# Altium project TASK_3.PrjPcb
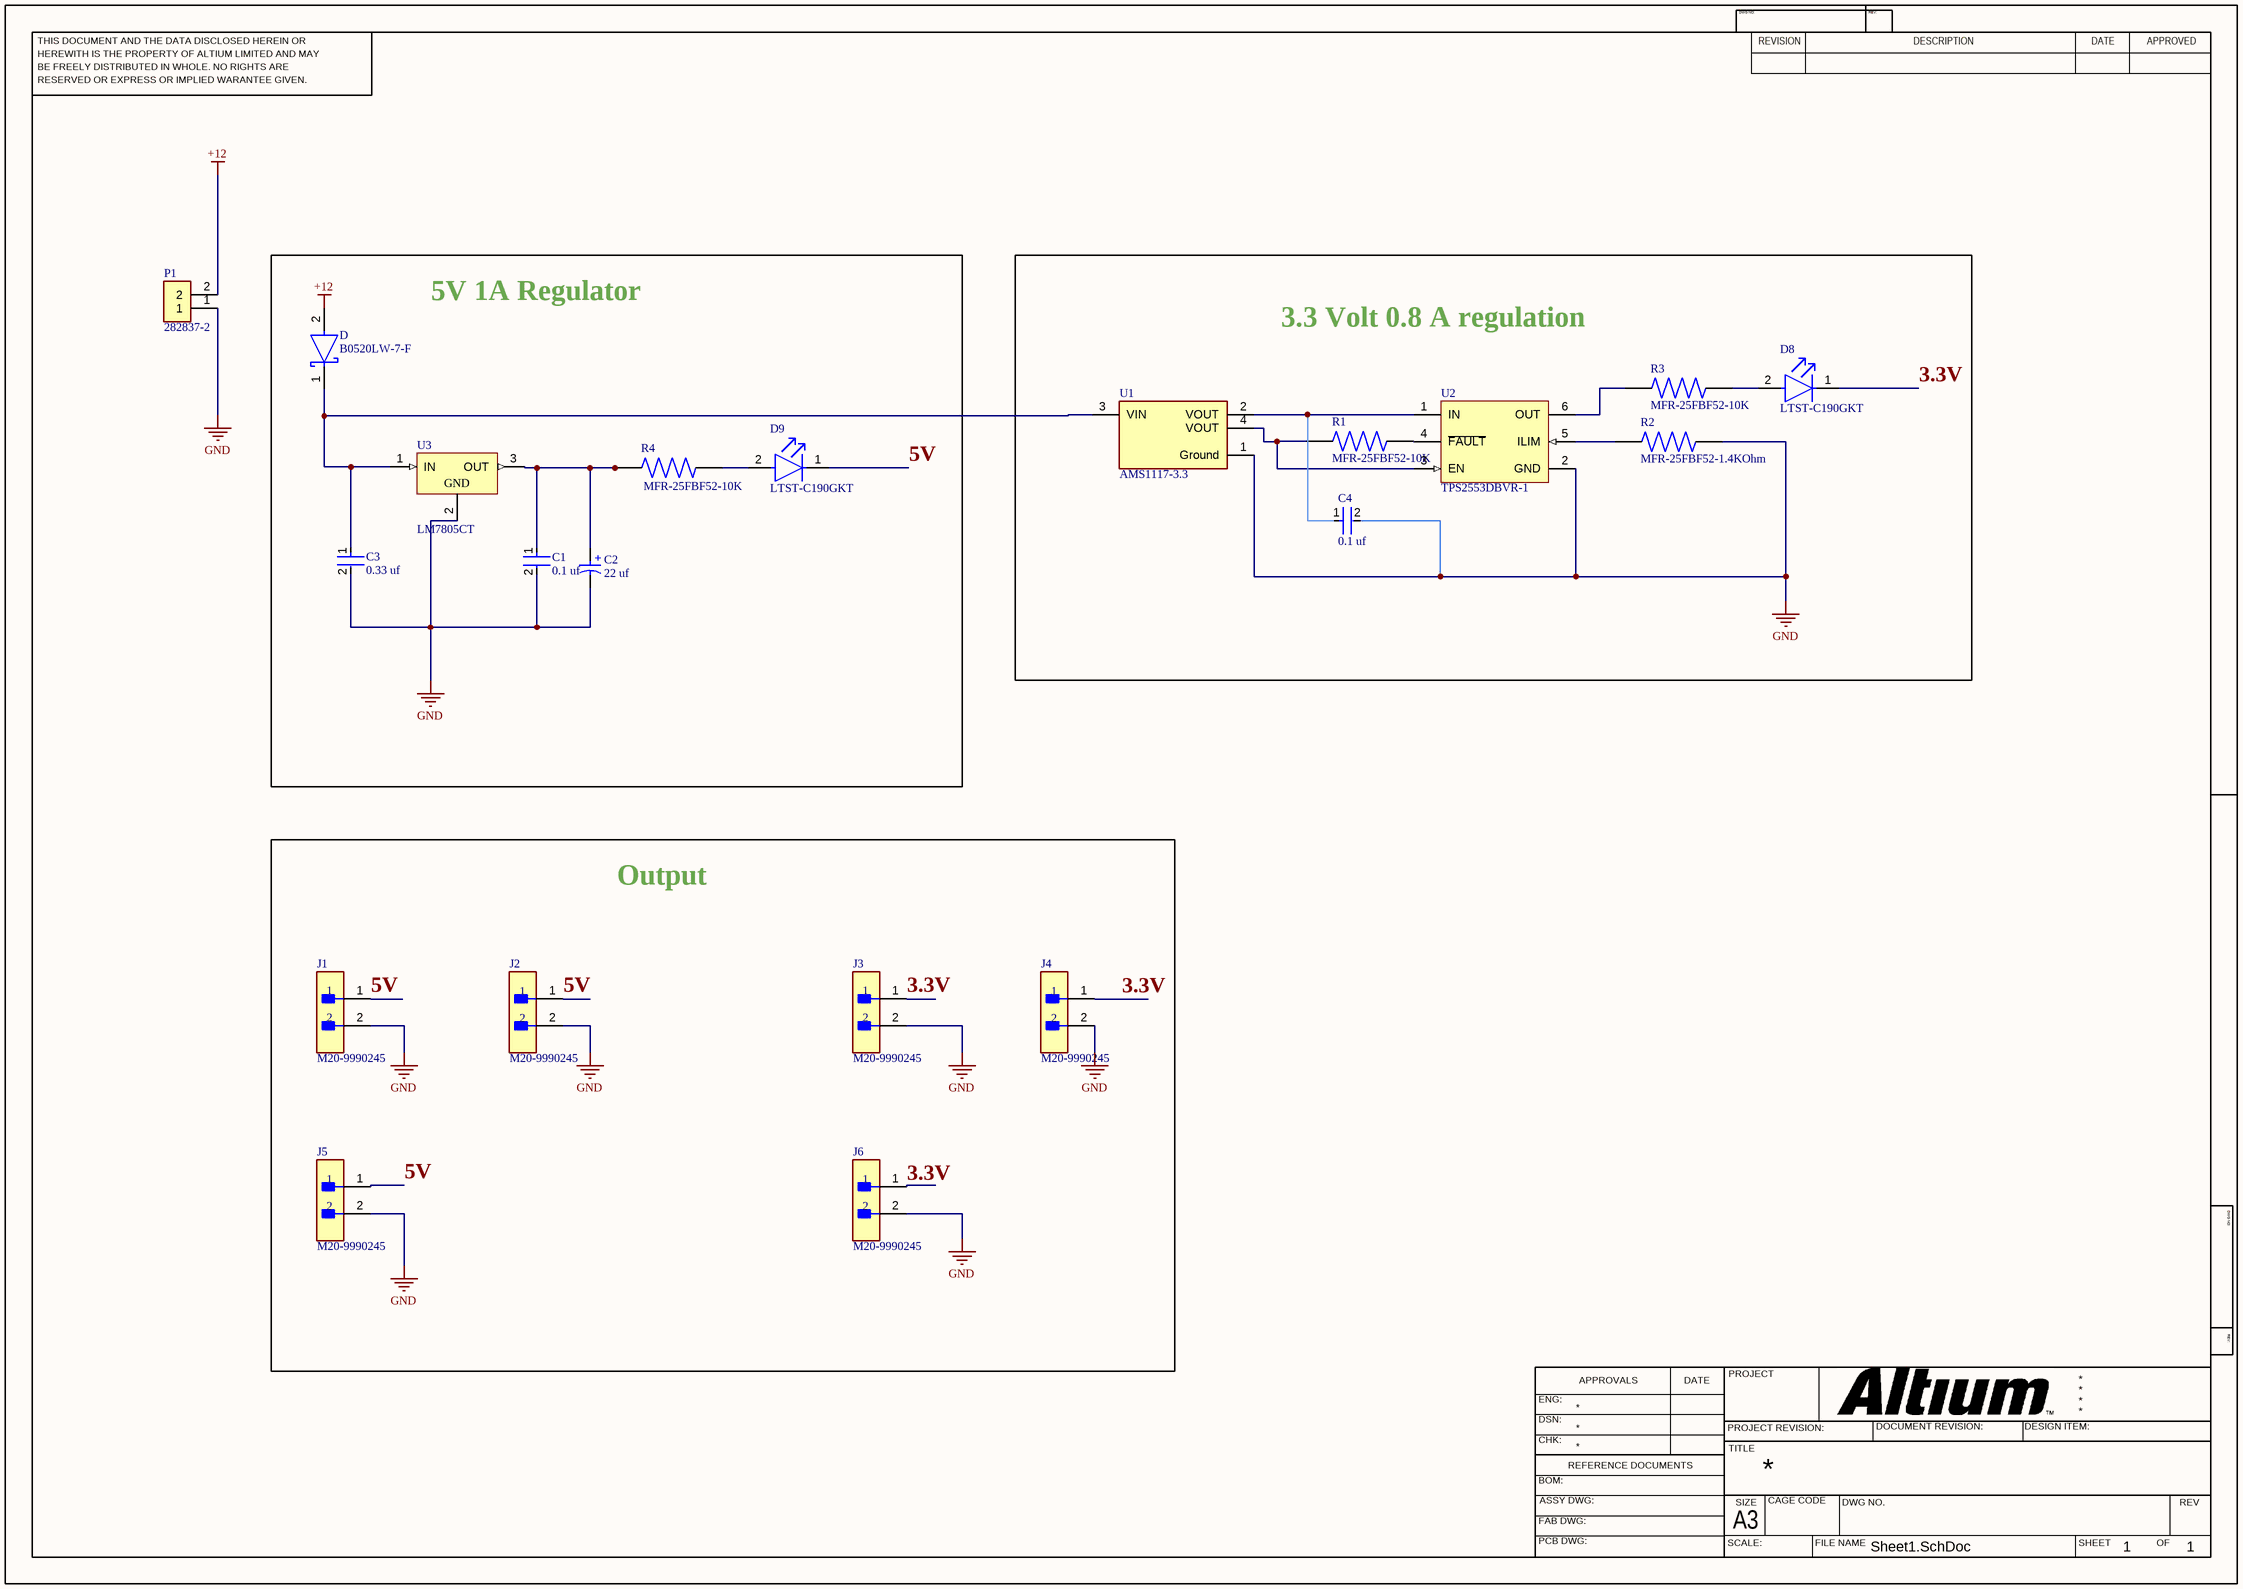
[diagram p0: Sheet1.SchDoc]
1 sheet, 21 parts. Net scope: global (net labels, ports and power ports of the same name join across sheets).
Board file: PCB1.PcbDoc

## Sheet Sheet1.SchDoc
size 420 x 297 mm; SheetNumber: 1; SheetTotal: 1

### Parts
C1  0.1 uf  [FP-CL17-IPC_C]
C2  22 uf  [WCAP-ASLL_D4H5.5]
C3  0.33 uf  [FP-GRM31C-0_2-e0_3_0_8-IPC_C]
C4  0.1 uf  [FP-CL17-IPC_C]
D  B0520LW-7-F  [FP-SOD123-MFG]
D8  LTST-C190GKT  [FP-LTST-C190GKT-MFG]
D9  LTST-C190GKT  [FP-LTST-C190GKT-MFG]
J1  M20-9990245  [FP-M20-9990245-MFG]
J2  M20-9990245  [FP-M20-9990245-MFG]
J3  M20-9990245  [FP-M20-9990245-MFG]
J4  M20-9990245  [FP-M20-9990245-MFG]
J5  M20-9990245  [FP-M20-9990245-MFG]
J6  M20-9990245  [FP-M20-9990245-MFG]
P1  282837-2  [TE_282837-2]
R1  MFR-25FBF52-10K  [RESAD1100W55L680D260]
R2  MFR-25FBF52-1.4KOhm  [RESAD1100W55L680D260]
R3  MFR-25FBF52-10K  [RESAD1100W55L680D260]
R4  MFR-25FBF52-10K  [RESAD1100W55L680D260]
U1  AMS1117-3.3  [FP-AMS1117-IPC_C]
U2  TPS2553DBVR-1  [DBV0006A_N]
U3  LM7805CT  [FAIR-TO-220-3]

### Blocks framed on the sheet
5V 1A Regulator: C1-C3 D D9 R4 U3
3.3 Volt 0.8 A regulation: C4 D8 R1-R3 U1 U2
Output: J1-J6

### Nets
+12: D.2(A) P1.2
GND: C1.2 C2.2(N) C3.2 C4.2 J1.2 J2.2 J3.2 J4.2 J5.2 J6.2 P1.1 R2.2 U1.1(Ground) U2.2(GND) U3.2(GND)
3.3V: D8.1(C) J3.1 J4.1 J6.1
5V: D9.1(C) J1.1 J2.1 J5.1
NetC1_1: C1.1 C2.1(P) R4.1 U3.3(OUT)
NetC3_1: C3.1 D.1(C) U1.3(VIN) U3.1(IN)
NetC4_1: C4.1 U1.2(VOUT) U2.1(IN)
NetD8_2: D8.2(A) R3.2
NetD9_2: D9.2(A) R4.2
NetR1_1: R1.1 U1.4(VOUT) U2.3(EN)
NetR1_2: R1.2 U2.4(~{FAULT})
NetR2_1: R2.1 U2.5(ILIM)
NetR3_1: R3.1 U2.6(OUT)

### Notes on the sheet
- THIS DOCUMENT AND THE DATA DISCLOSED HEREIN OR
- HEREWITH IS THE PROPERTY OF ALTIUM LIMITED AND MAY
- DWG NO:
- REVISION
- REV:
- DESCRIPTION
- DATE
- APPROVED
- BE FREELY DISTRIBUTED IN WHOLE. NO RIGHTS ARE
- RESERVED OR EXPRESS OR IMPLIED WARANTEE GIVEN.
- ENG:
- APPROVALS
- PROJECT
- DSN:
- CHK:
- REFERENCE DOCUMENTS
- PROJECT REVISION:
- TITLE
- DOCUMENT REVISION:
- DESIGN ITEM:
- BOM:
- FAB DWG:
- PCB DWG:
- ASSY DWG:
- SCALE:
- A3
- SIZE
- CAGE CODE
- FILE NAME
- DWG NO.
- SHEET
- OF
- REV
- (in symbol CMP-03913-53914501-2) +

### Library data of the parts
C1 C4 = CMP-13271-001069-1: Cap Ceramic 100nF 10V X7R ±10% SMD 0402 +125°C Paper T/R; Height: 0.5mm; Case/Package: 0402; Contact Plating: Tin; Case Code (Imperial): 0402; Capacitance: 100nF; Thickness: 0.022inch; Min Operating Temperature: -55°C; Package Quantity: 1; Length: 1mm; Max Operating Temperature: 125°C; Depth: 0.5mm; Voltage Rating: 10V; Packaging: Tape and Reel; Mount: Surface Mount; Tolerance: 10%; Width: 0.02inch; Radiation Hardening: No; Case Code (Metric): 1005; Dielectric: X7R
C2 = CMP-03913-53914501-2: 865060240001 WCAP-ASLL Aluminum Electrolytic Capacitors; Voltage Rating (DC): 10V; Leakage Current: 3µA; Ripple Current (AC): 90mA; Insulation Resistance: 3.33333MΩ; ESR (Equivalent Series Resistance): 1.70696Ω; Tolerance: 20%; Polarity: Polar; Capacitance: 22µF; Impedance: 1.35Ω; Life (Hours): 2000hours; Max Operating Temperature: 105°C; REACH SVHC: Unknown; Length: 5.5mm; RoHS: Compliant; Voltage Rating: 10V; Mount: Surface Mount; Height - Seated (Max): 5.5118mm; Ripple Current: 90mA; NexarPartId: 53914501; Diameter: 4mm; Min Operating Temperature: -55°C; Case/Package: Radial; Height: 5.5mm
C3 = CMP-06035-063427-1: CAP CER 0.33UF 25V C0G/NP0 1206; RoHS Compliant: Yes
D = CMP-12790-000026-1: DIODE SCHOTTKY 20V 500MA SOD123; Manufacturer: Diodes Inc.; Max Junction Temp: +125°C; Value: 170pF; Max Surge Forward Current: 5.5A; Forward Current: 0.5A; Standoff Height: 0mm; Peak Reverse Current: 250uA; Octopart: https://octopart.com/b0520lw-7-f-diodes+inc.-325707; Mouser Description: Schottky Diodes & Rectifiers 20V 410mW; ComponentLink2Description: Datasheet; Ipc Land Pattern Name: SOD365155X123-2; Device Class L1: Discrete Semiconductors; Category: Diode; ComponentLink2URL: https://www.diodes.com/assets/Datasheets/ds30051.pdf; Footprint Url: https://www.diodes.com/assets/Package-Files/SOD123.pdf; Package: SOD123; Device Class L3: Schottky Diodes; Digikey Description: DIODE SCHOTTKY 20V 500MA SOD123; Temperature Range Low: -65°C; RoHS: TRUE; Max Repetitive Reverse Voltage: 20V; Lead Free: Yes; Temperature: -65°C to +125°C; Reverse Voltage: 20V; Temperature Range High: +125°C; Capacitance: 170pF; Device Class L2: Diodes; Automotive: No; Height: 1.45mm; Manufacturer Part Number: B0520LW-7-F
D8 D9 = CMP-22017-000005-2: LED GREEN CLEAR CHIP SMD; Dominant Wavelength: 569nm; Reverse Voltage: 5V; Lens Color: Colorless; Viewing Angle: 130°; Voltage: 2V; Forward Current: 30mA; Power Dissipation: 100mW; Luminous Intensity: 6mcd; Number of LEDs: 1; Forward Voltage: 2.1V; Wavelength: 565nm; Test Current: 10mA; Min Operating Temperature: -55°C; Lens Style: Clear; Mount: Surface Mount; Width: 0.8mm; Packaging: Tape and Reel; Lens Transparency: Clear; Case Code (Metric): 1608; Depth: 0.8mm; Case Code (Imperial): 0603; Case/Package: 0603; Number of Pins: 2; Max Operating Temperature: 85°C; Lead Free: Lead Free; Number of Elements: 1; Length: 1.6mm; Height: 0.8mm; Package Quantity: 1; Power Rating: 100mW; Radiation Hardening: No; Illumination Color: Green; Color: Green
J1-J6 = CMP-15831-000105-1: CONN HEADER VERT 2POS 2.54MM; Working Voltage: 750V; Gender: Male; Number of Poles: 2; Current Rating: 3A; Mated Stacking Heights: 16.54mm; Contact Resistance: 25mR; Connector Type: Male Pin; Insulation Resistance: 10GR; Mating Cycles: 300; Voltage: 50V; Flammability Rating: UL94 V-0; Pitch: 2.54mm; Series: M20; Number of Contacts: 2; Height: 0.12inch; Min Operating Temperature: -40°C; Contact Finish - Mating: GOLD; Number of Positions: 2; Number of Rows: 1; Packaging: Bulk; Package Quantity: 1000; Voltage Rating (AC): 750V; Current: 3A; Mount: Through Hole; Case/Package: SIL; Orientation: Straight; Contact Shape: Square; Weight: 0.25lb; Radiation Hardening: No; Fastening Type: Pull; Length: 5.08mm; Depth: 2.54mm; Contact Mating Length: 0.24inch; Housing Material: Nylon; Reach SVHC Compliant: Yes; Insulation Material: Nylon; Color: Black; Width: 0.25inch; Insulation Color: Black; Contact Material: Brass; Contact Type: Male Pin; Termination: Solder; Max Operating Temperature: 105°C; Contact Plating: Gold; Housing Color: Black; Max Current Rating: 3A; Lead Pitch: 2.54mm
P1 = 282837-2: Ð Ð°Ð·ÑŠÐµÐ¼Ð½Ñ‹Ðµ ÐºÐ»ÐµÐ¼Ð¼Ð½Ñ‹Ðµ ÐºÐ¾Ð»Ð¾Ð´ÐºÐ¸ Ð Ð¾Ð·ÐµÑ‚ÐºÐ° 2 Ð¿Ð¾Ð»Ð¾Ð¶ÐµÐ½Ð¸Ñ 5,08 Ð¼Ð¼ ÐŸÑ€Ð¸Ð¿Ð¾Ð¹ Ð¿Ñ€ÑÐ¼Ð¾Ð¹ Ñ‡ÐµÑ€ÐµÐ· Ð¾Ñ‚Ð²ÐµÑ€ÑÑ‚Ð¸Ðµ 13,5 Ð / ÐºÐ¾Ð½Ñ‚Ð°ÐºÑ‚; MF: TE Connectivity; SnapEDA_Link: https://www.snapeda.com/parts/282837-2/TE+Connectivity+AMP+Connectors/view-part/?ref=snap; Price: None; Check_prices: https://www.snapeda.com/parts/282837-2/TE+Connectivity+AMP+Connectors/view-part/?ref=eda; Purchase-URL: https://pricing.snapeda.com/search/part/282837-2/?ref=eda; MP: 282837-2; Value: *; Availability: In Stock; Package: None
R1-R4 = MFR-25FBF52-10K: 10.2 kOhms Â±1% 0.25W, 1/4W Through Hole Resistor Axial - Metal Film; MF: Yageo; SnapEDA_Link: https://www.snapeda.com/parts/MFR-25FBF52-10K/Yageo/view-part/?ref=snap; Package: RADIAL-2 YAGEO; Value: *; MP: MFR-25FBF52-10K; Check_prices: https://www.snapeda.com/parts/MFR-25FBF52-10K/Yageo/view-part/?ref=eda
U1 = CMP-209535-000001-1: LDO Voltage Regulators 1A, 3.3V; Manufacturer: Advanced Monolithic Systems; Dropout Voltage: 1.1V; Output Type: Fixed; Nominal Supply Current: 5mA; Max Power Dissipation: 1.2W; Max Supply Voltage: 15V; Number Of Outputs: 1; Standoff Height: 0.64mm; Max Junction Temp: +125°C; Height: 1.8mm; Package: AMS1117; Device Class L2: Power Management ICs; ComponentLink2Description: Datasheet; ComponentLink2URL: http://www.advanced-monolithic.com/pdf/ds1117.pdf; Category: IC; RoHS: TRUE; Automotive: No; Device Class L1: Integrated Circuits (ICs); Output Current: 1A; Device Class L3: Voltage Regulators - Linear; Temperature: -40°C to +125°C; Output Voltage: 3.3V; Manufacturer Part Number: AMS1117-3.3; Temperature Range Low: -40°C; Octopart: https://octopart.com/ams1117-3.3-advanced+monolithic+systems-25899300; Lead Free: Yes; Ipc Land Pattern Name: SOT229P700X180-4; Temperature Range High: +125°C
U2 = CMP-0337-00282-2: Adjustable, Active High, Latch-off, Current-Limited Power-Distribution Switch, 0.075 to 1.7 A Current Limit, -40 to 85 degC, 6-pin SOT-23 (DBV), Green (RoHS & no Sb/Br); Manufacturer: Texas Instruments; rDS(on) per FET(Typ)(mOhms): 100/DRV, 85/DBV; Vin(Max)(V): 6.5; Continuous Current(Max)(A): 1.5; Current Limit Accuracy @ 1A: +/-7.5% (925mA min / 1075mA max); Rating: Catalog; Number of Switches: 1; Vin(Min)(V): 2.5; Enable: Active High; Current Limit(A): 0.075 to 1.7; Code_JEDEC: MO-178-AB*; Current Limit Topology: Latch-off; Mounting Technology: Surface Mount; PackageDescription: 6-Pin Plastic Small-Outline Package, 2.9 x 1.6 mm Body, 0.95 mm Pitch, 2.8 mm Lead Span; PartNumber: TPS2553DBVR-1; Eco-Plan: Green (RoHS & no Sb/Br); DatasheetVersion: SLVS841E; ComponentLink1Description: Datasheet; PackageVersion: revK, Mar-2006; ComponentLink1URL: http://www.ti.com/general/docs/lit/getliterature.tsp?genericPartNumber=TPS2553-1&fileType=pdf; PackageReference: DBV0006A
U3 = CMP-2000-04938-1: Positive Voltage Regulator, 5 V, 1 A, -40 to 125 degC, 3-Pin TO-220, RoHS, Tube; Manufacturer: FairchildSemiconductor; Maximum Input Voltage: 35V; Maximum Quiescent Current: 8mA; Load Regulation: 100mV; Maximum Output Current: 2.2(Typ)A; Output Type: Fixed; Typical Dropout Voltage @ Current: 2@1AV; Rad Hard: No; Output Voltage: 5V; Accuracy: ±4%; Number of Outputs: 1; Category: LinearRegulator; Package Description: 3-Pin Through Hole Device, Body 10 x 4.5 mm, Pitch 2.54 mm; Packaging: Rail/Tube; Mounting: ThroughHole; Polarity: Positive; Manufacturer URL: https://www.fairchildsemi.com/; Line Regulation: 100mV; Datasheet Version: Aug-12; Datasheet URL: https://datasheet.ciiva.com/26904/lm7805ct-26904988.pdf; Package Reference: TO-220; Package URL: https://www.fairchildsemi.com/package-drawings/TO/TO220B03.pdf; Package: 3TO-220AB; Operating Temperature: -40to125degC; Type: Linear